# EAGLE design Brain Conn Disconnect (all on one) (EAGLE 9.6.2)
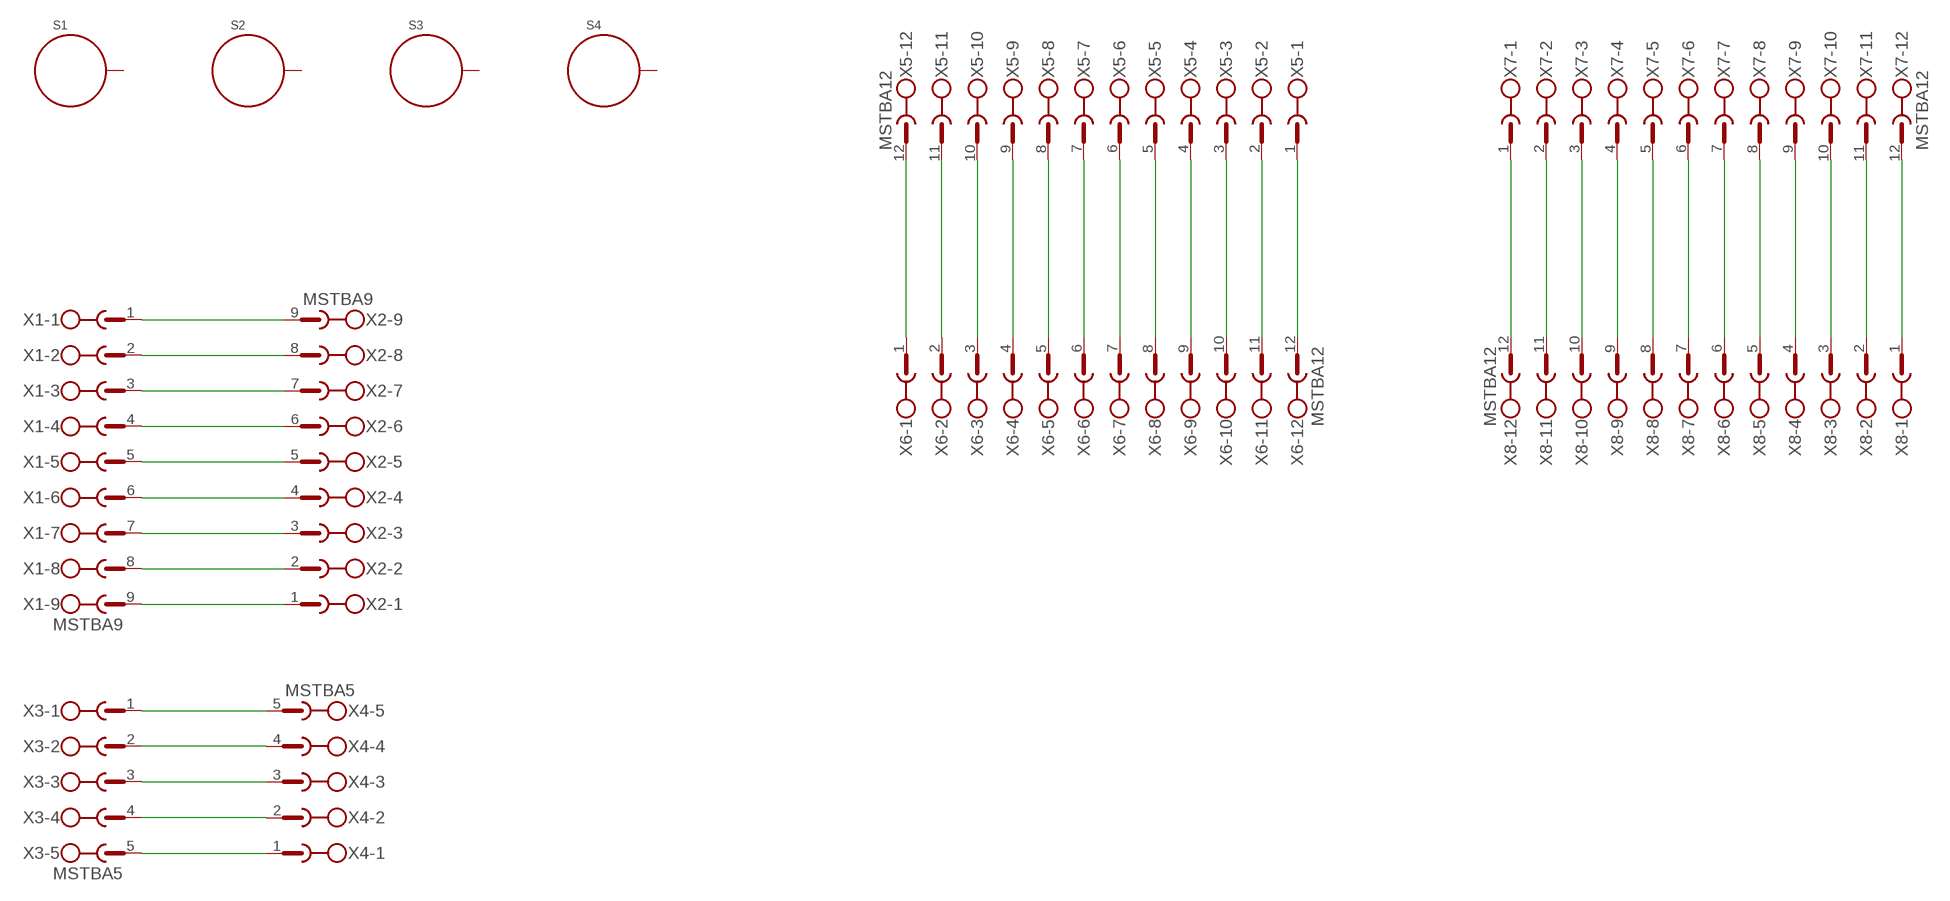
[diagram p0: schematic, sheet 1]

## Parts
S1  STANDOFF_ELECTRICAL144  [STANDOFF_ELECTRICAL_144MILL_NORMAL_SCREW]
S2  STANDOFF_ELECTRICAL144  [STANDOFF_ELECTRICAL_144MILL_NORMAL_SCREW]
S3  STANDOFF_ELECTRICAL144  [STANDOFF_ELECTRICAL_144MILL_NORMAL_SCREW]
S4  STANDOFF_ELECTRICAL144  [STANDOFF_ELECTRICAL_144MILL_NORMAL_SCREW]
X1  MSTBA9  [MSTBA9]
X2  MSTBA9  [MSTBA9]
X3  MSTBA5  [MSTBA5]
X4  MSTBA5  [MSTBA5]
X5  MSTBA12  [MSTBA12]
X6  MSTBA12  [MSTBA12]
X7  MSTBA12  [MSTBA12]
X8  MSTBA12  [MSTBA12]

## Nets
N$1: X3.1 X4.5
N$2: X3.2 X4.4
N$3: X3.3 X4.3
N$4: X3.4 X4.2
N$5: X3.5 X4.1
N$6: X1.1 X2.9
N$7: X1.2 X2.8
N$8: X1.3 X2.7
N$9: X1.4 X2.6
N$10: X1.5 X2.5
N$11: X1.6 X2.4
N$12: X1.7 X2.3
N$13: X1.8 X2.2
N$14: X1.9 X2.1
N$15: X5.12 X6.1
N$16: X5.11 X6.2
N$17: X5.10 X6.3
N$18: X5.9 X6.4
N$19: X5.8 X6.5
N$20: X5.7 X6.6
N$21: X5.6 X6.7
N$22: X5.5 X6.8
N$23: X5.4 X6.9
N$24: X5.3 X6.10
N$25: X5.2 X6.11
N$26: X5.1 X6.12
N$27: X7.1 X8.12
N$28: X7.2 X8.11
N$29: X7.3 X8.10
N$30: X7.4 X8.9
N$31: X7.5 X8.8
N$32: X7.6 X8.7
N$33: X7.7 X8.6
N$34: X7.8 X8.5
N$35: X7.9 X8.4
N$36: X7.10 X8.3
N$37: X7.11 X8.2
N$38: X7.12 X8.1
Unconnected: S1.P1 S2.P1 S3.P1 S4.P1

## Library data of the parts
S1-S4 = th_libraries:STANDOFF_ELECTRICAL: A standoff intended to be an electrically connected point. Pad size and stop size allow for a #8 Phillips pan screw head to make a solid connection to the board. Added 144mill drill hole that fits my normal wood screw
X1 X2 = con-phoenix-508:MSTBA9: PHOENIX; MF: FARNELL; MPN: 1757310; OC_FARNELL: 3705237; OC_NEWARK: 71C4167
X3 X4 = con-phoenix-508:MSTBA5: PHOENIX; MPN: 1757271; OC_FARNELL: 3705201; OC_NEWARK: 71C4164
X5-X8 = con-phoenix-508:MSTBA12: PHOENIX; MPN: 1757349; OC_FARNELL: 3705250; OC_NEWARK: 71C4169

## Board
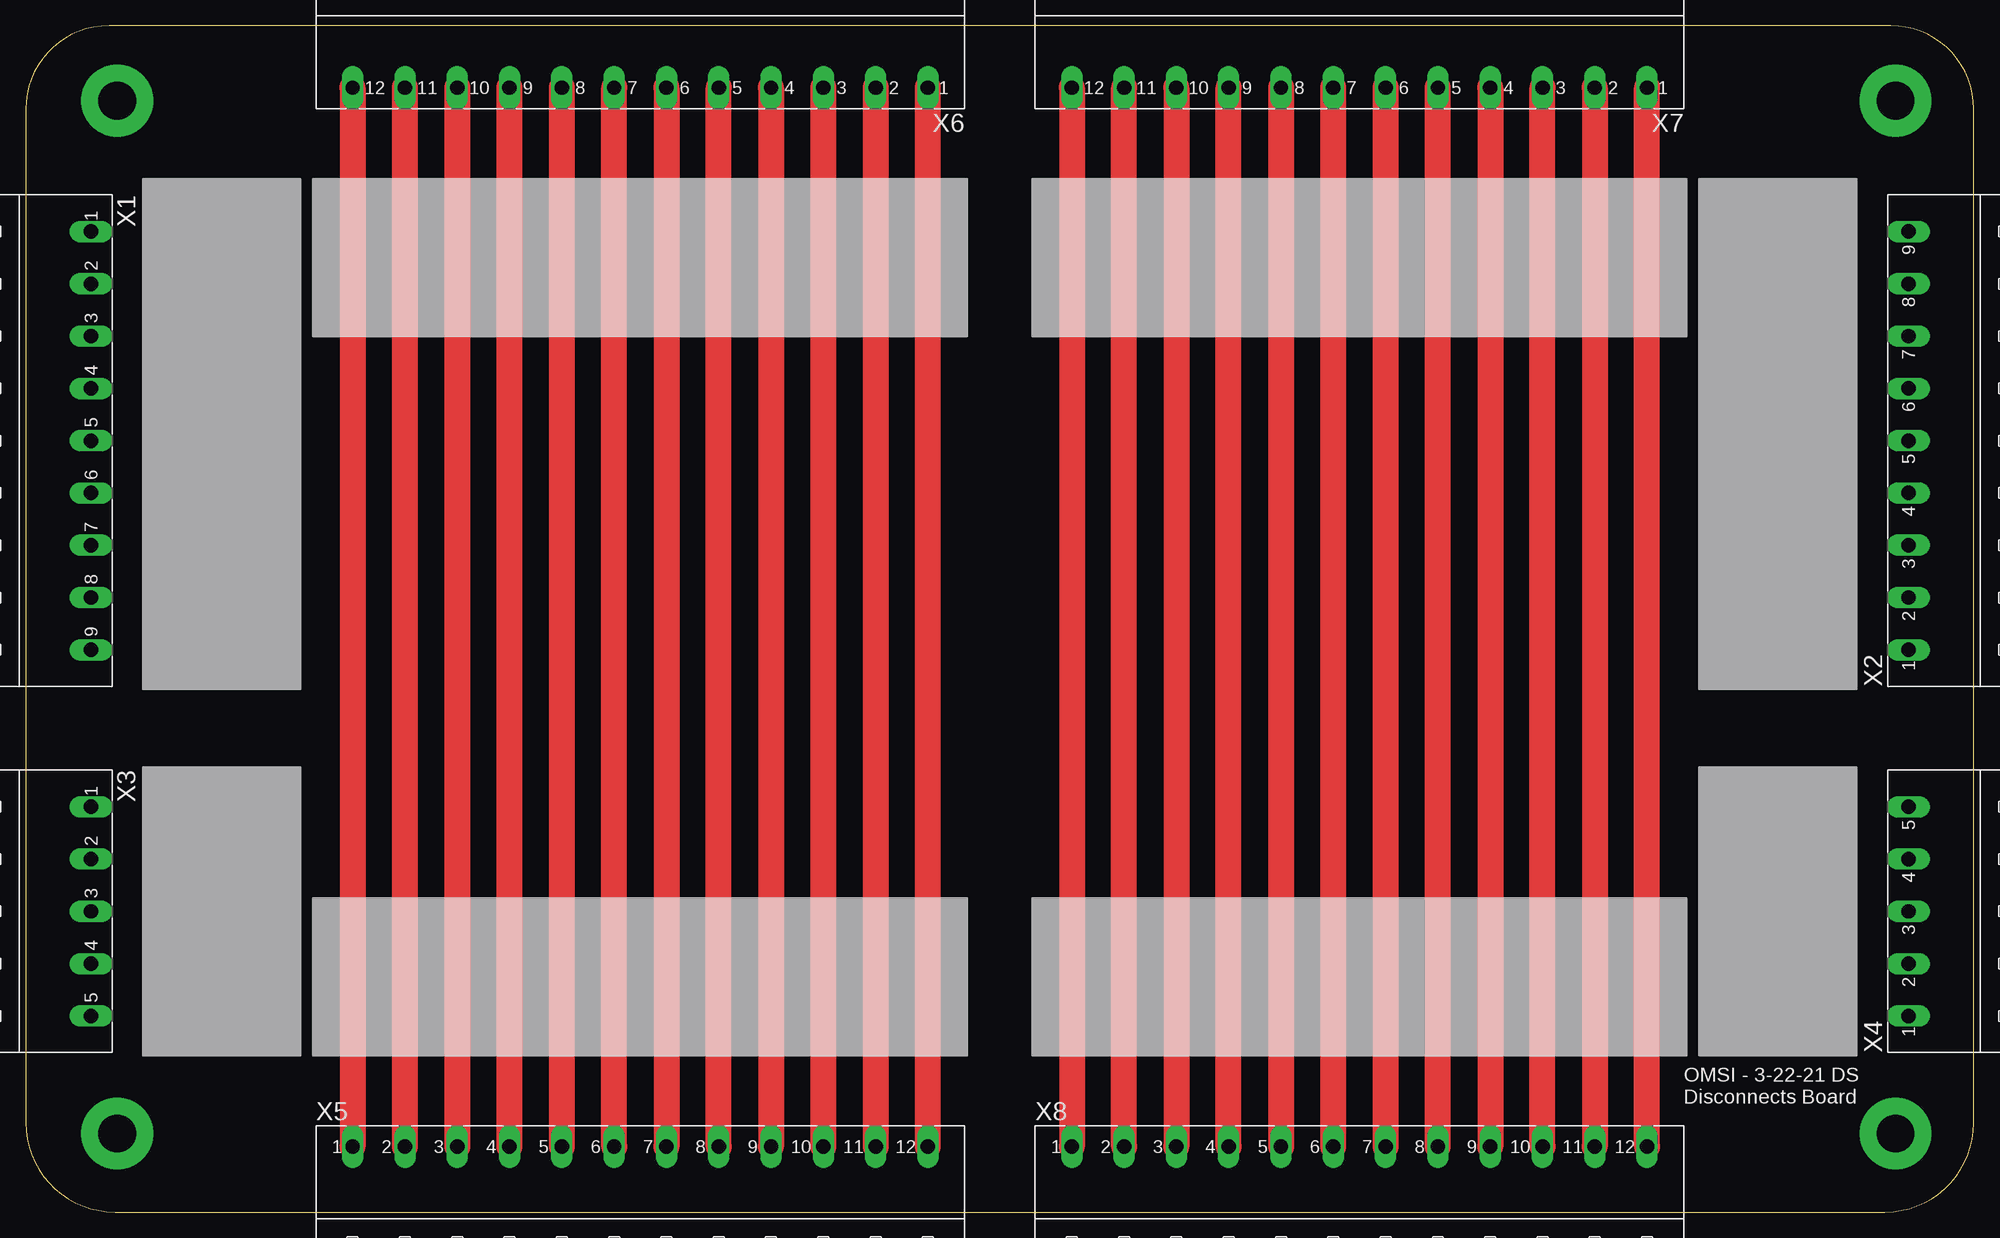
[diagram p1: board, top side]
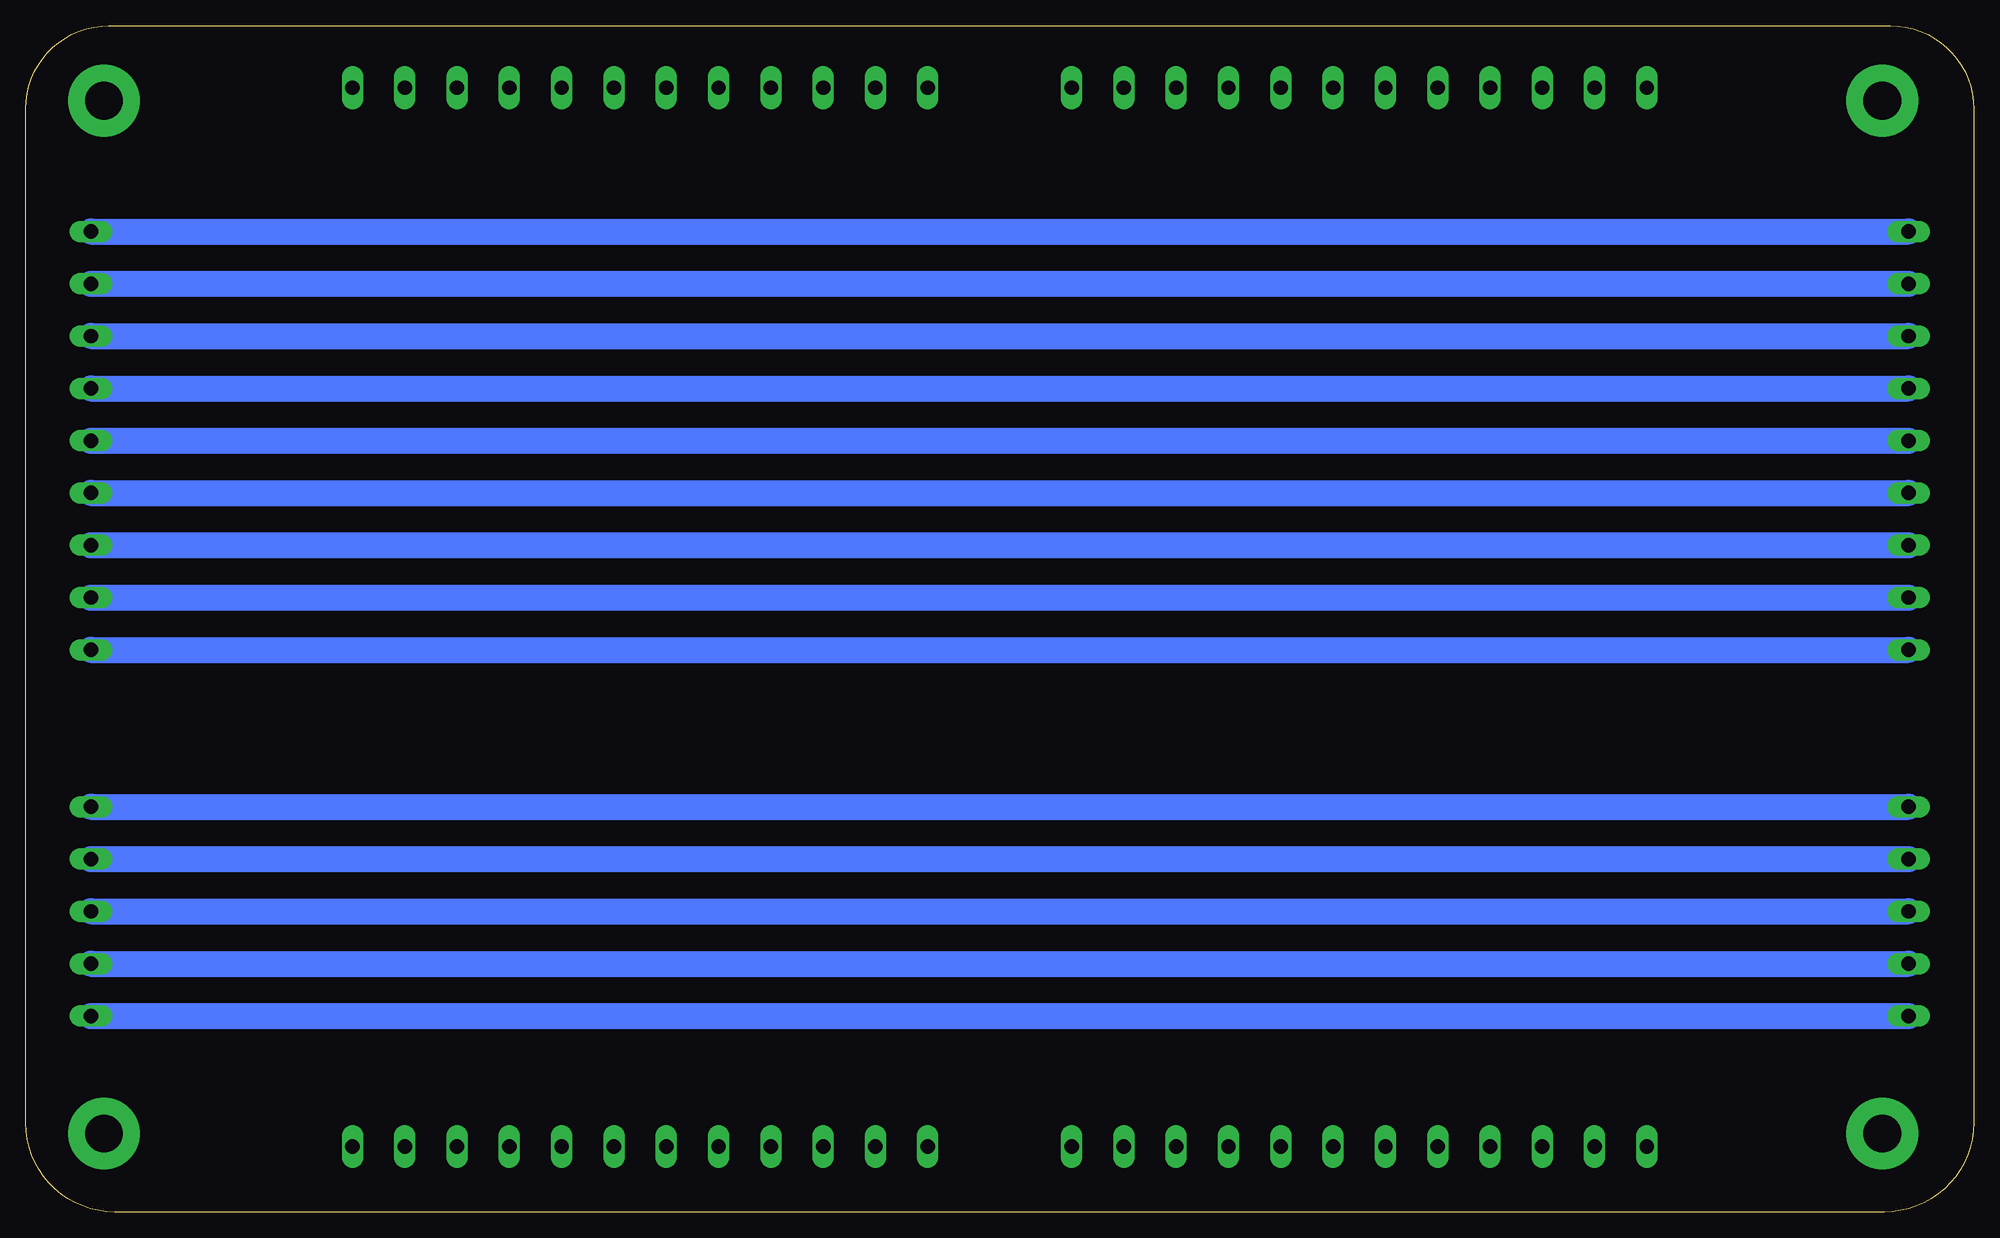
[diagram p2: board, bottom side, seen from below]

Size 189.21 x 115.24 mm. Coordinates in mm from the lower left corner, seen from the top.
Outline: 189.21,8.64 189.21,107.17 arc90 181.14,115.24 8.1,115.24 arc90 0,107.14 0,8.67 arc90 8.67,0 180.57,0 arc90 189.21,8.64
Copper layers (1*16): Top 0.035mm / dielectric 1.5mm / Bottom 0.035mm
Design rules "default": minimum track width 6mil, minimum drill 0.35mm, track to track 6mil, track to pad 6mil, pad to pad 6mil, via to via 6mil, smd to smd 6mil, copper to edge 40mil, drill to drill 6mil, minimum pad ring 10mil, minimum via ring 8mil, stop-mask expansion 4mil, vias tented up to drill 0mil, thermal gap 10mil

### Footprints (pad centres in the part's own frame; a part is rotated, then mirrored left to right if it is on the bottom)
STANDOFF_ELECTRICAL_144MILL_NORMAL_SCREW = drill 3.658 pad 6.985: P1 0,0
MSTBA9 = drill 1.397 long: 1 -20.32,5.08; 2 -15.24,5.08; 3 -10.16,5.08; 4 -5.08,5.08; 5 0,5.08; 6 5.08,5.08; 7 10.16,5.08; 8 15.24,5.08; 9 20.32,5.08
MSTBA5 = drill 1.397 long: 1 -10.16,5.08; 2 -5.08,5.08; 3 0,5.08; 4 5.08,5.08; 5 10.16,5.08
MSTBA12 = drill 1.397 long: 1 -27.94,5.08; 2 -22.86,5.08; 3 -17.78,5.08; 4 -12.7,5.08; 5 -7.62,5.08; 6 -2.54,5.08; 7 2.54,5.08; 8 7.62,5.08; 9 12.7,5.08; 10 17.78,5.08; 11 22.86,5.08; 12 27.94,5.08

### Placement (x,y rotation side)
S1  8.89,7.62 0 top
S2  8.89,107.95 0 top
S3  181.61,7.62 0 top
S4  181.61,107.95 0 top
X1  1.27,74.93 270 top
X2  187.96,74.93 90 top
X3  1.27,29.21 270 top
X4  187.96,29.21 90 top
X5  59.69,1.27 0 top
X6  59.69,114.3 180 top
X7  129.54,114.3 180 top
X8  129.54,1.27 0 top

### Tracks (layer width: path | path; a pad name or v marks a point on that pad's centre or on a via)
N$1
  Bottom 2.54: X4.5 X3.1
N$2
  Bottom 2.54: X4.4 X3.2
N$3
  Bottom 2.54: X4.3 X3.3
N$4
  Bottom 2.54: X4.2 X3.4
N$5
  Bottom 2.54: X4.1 X3.5
N$6
  Bottom 2.54: X2.9 X1.1
N$7
  Bottom 2.54: X2.8 X1.2
N$8
  Bottom 2.54: X2.7 X1.3
N$9
  Bottom 2.54: X2.6 X1.4
N$10
  Bottom 2.54: X2.5 X1.5
N$11
  Bottom 2.54: X2.4 X1.6
N$12
  Bottom 2.54: X2.3 X1.7
N$13
  Bottom 2.54: X2.2 X1.8
N$14
  Bottom 2.54: X2.1 X1.9
N$15
  Top 2.54: X5.12 X6.1
N$16
  Top 2.54: X6.2 X5.11
N$17
  Top 2.54: X5.10 X6.3
N$18
  Top 2.54: X6.4 X5.9
N$19
  Top 2.54: X5.8 X6.5
N$20
  Top 2.54: X6.6 X5.7
N$21
  Top 2.54: X5.6 X6.7
N$22
  Top 2.54: X6.8 X5.5
N$23
  Top 2.54: X5.4 X6.9
N$24
  Top 2.54: X6.10 X5.3
N$25
  Top 2.54: X5.2 X6.11
N$26
  Top 2.54: X6.12 X5.1
N$27
  Top 2.54: X8.12 X7.1
N$28
  Top 2.54: X7.2 X8.11
N$29
  Top 2.54: X8.10 X7.3
N$30
  Top 2.54: X7.4 X8.9
N$31
  Top 2.54: X8.8 X7.5
N$32
  Top 2.54: X7.6 X8.7
N$33
  Top 2.54: X8.6 X7.7
N$34
  Top 2.54: X7.8 X8.5
N$35
  Top 2.54: X8.4 X7.9
N$36
  Top 2.54: X7.10 X8.3
N$37
  Top 2.54: X8.2 X7.11
N$38
  Top 2.54: X7.12 X8.1

### Text on the board
tPlace: OMSI - 3-22-21 DS / Disconnects Board